# EAGLE design Gas_Sensor_Breakout-v1.0 (EAGLE 5.11)
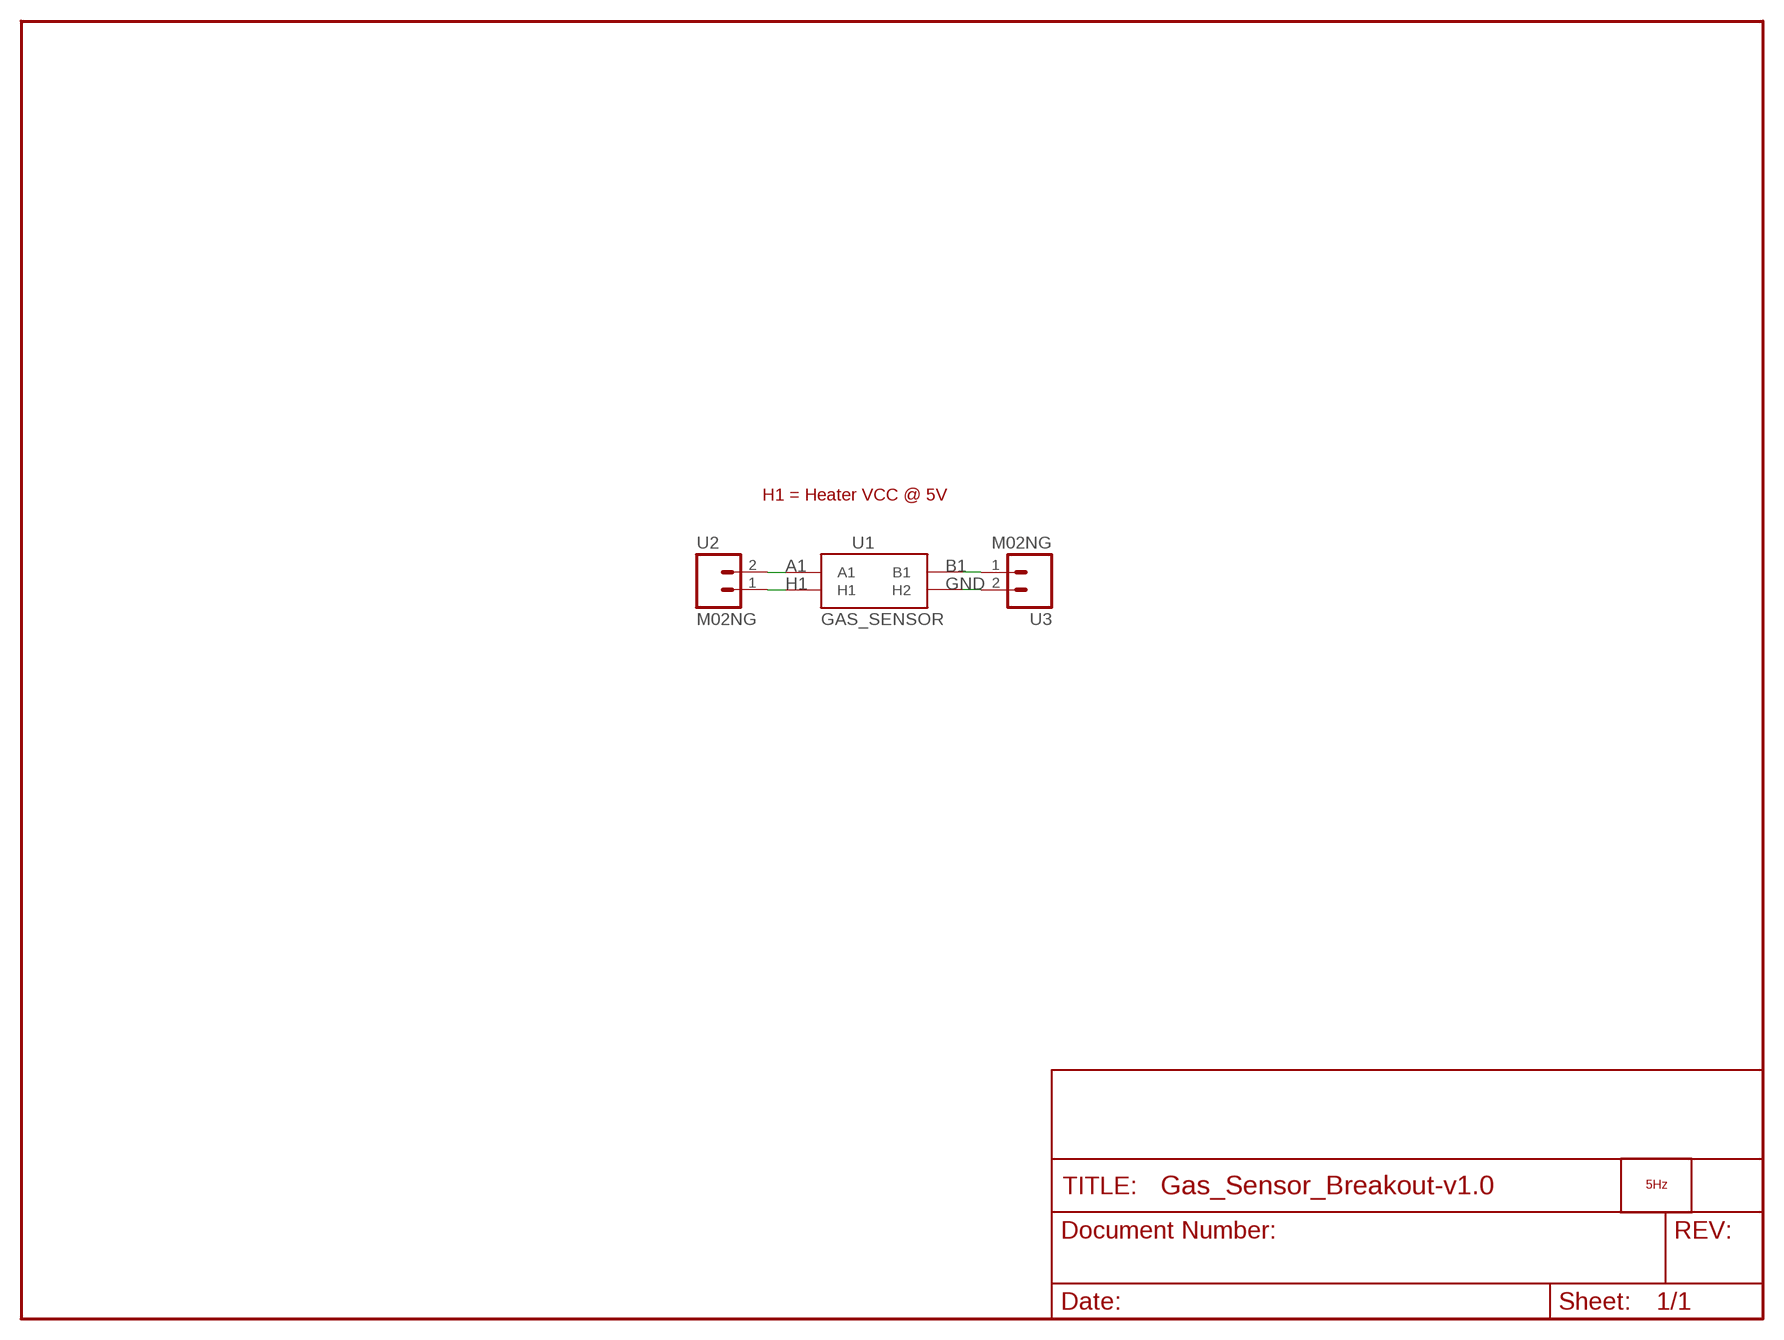
[diagram p0: schematic, sheet 1]

## Parts
LOGO2  LOGO_5HZ_CIRC_2MM  [5HZ_LOGO_CIRC_2MM]
U1  GAS_SENSOR  [MQ-3]
U2  M02NG  [1X02]
U3  M02NG  [1X02]

## Nets
A1: U1.A1 U2.2
B1: U1.B1 U3.1
GND: U1.HB(H2) U3.2
H1: U1.HA(H1) U2.1

## Notes on the sheet
- H1 = Heater VCC @ 5V

## Library data of the parts
LOGO2 = 5hz-electronica_pirata:LOGO_5HZ: Logotipo 5Hz "según Pedro"
U1 = SparkFun:GAS_SENSOR: MQ-3 Gas Sensor. FP not tested. Part#
U2 U3 = SparkFun:M02NG

## Board
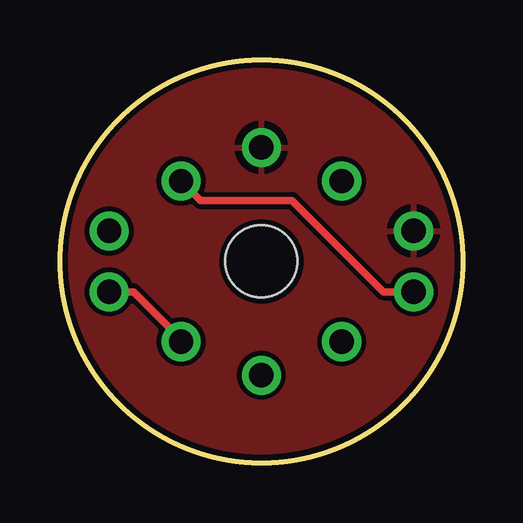
[diagram p1: board, top side]
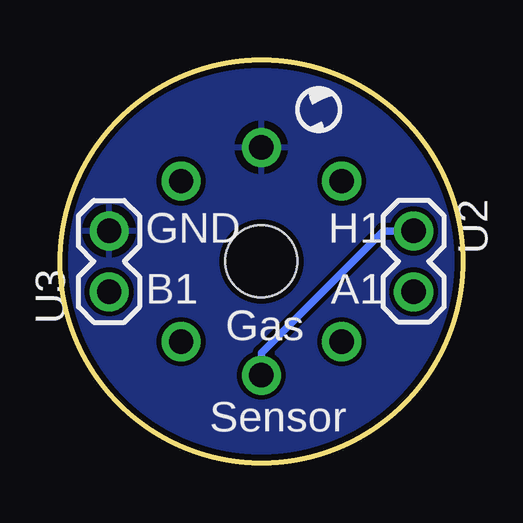
[diagram p2: board, bottom side, seen from below]

Size 16.8 x 16.8 mm. Coordinates in mm from the lower left corner, seen from the top.
Outline: circle at 8.4,8.4 radius 8.4
Copper layers (1*16): Top 0.0356mm / dielectric 1.5011mm / Bottom 0.0356mm
Design rules "default *": minimum track width 8mil, minimum drill 20mil, track to track 8mil, track to pad 8mil, pad to pad 8mil, via to via 8mil, smd to smd 8mil, copper to edge 10mil, drill to drill 8mil, minimum pad ring 12mil, minimum via ring 10mil, stop-mask expansion 4mil, vias tented up to drill 20mil, thermal gap 12mil

### Footprints (pad centres in the part's own frame; a part is rotated, then mirrored left to right if it is on the bottom)
MQ-3 = drill 1.016 round: A1 -3.35,3.35; A2 -3.35,-3.35; B1 3.35,3.35; B2 3.35,-3.35; HA -4.75,0; HB 4.75,0 | hole 3: 0,0
1X02 = drill 1.016 round: 1 0,0; 2 2.54,0

### Placement (x,y rotation side)
LOGO2  7,13.73 0 bottom
U1  8.4,8.4 90 top
U2  2.05,9.67 270 bottom
U3  14.75,7.13 90 bottom

### Tracks (layer width: path | path; a pad name or v marks a point on that pad's centre or on a via)
A1
  Top 0.305: U2.2 3.07,7.13 5.1,5.1 U1.A1
B1
  Top 0.305: U3.1 13.48,7.13 9.67,10.94 5.86,10.94 U1.B1
GND
  pour Bottom: -0.49,-0.49 17.29,-0.49 17.29,17.29 -0.49,17.29
  pour Top: -0.49,-0.49 17.29,-0.49 17.29,17.29 -0.49,17.29
H1
  Bottom 0.305: U2.1 2.3,9.67 3.32,9.67 8.4,4.59 U1.HA 8.4,3.57

### Text on the board
bPlace: H1 | GND | A1 | Gas | B1 | Sensor